# Altium schematic sheet Top.SchDoc
size A4; SheetNumber: 1; SheetTotal: 1
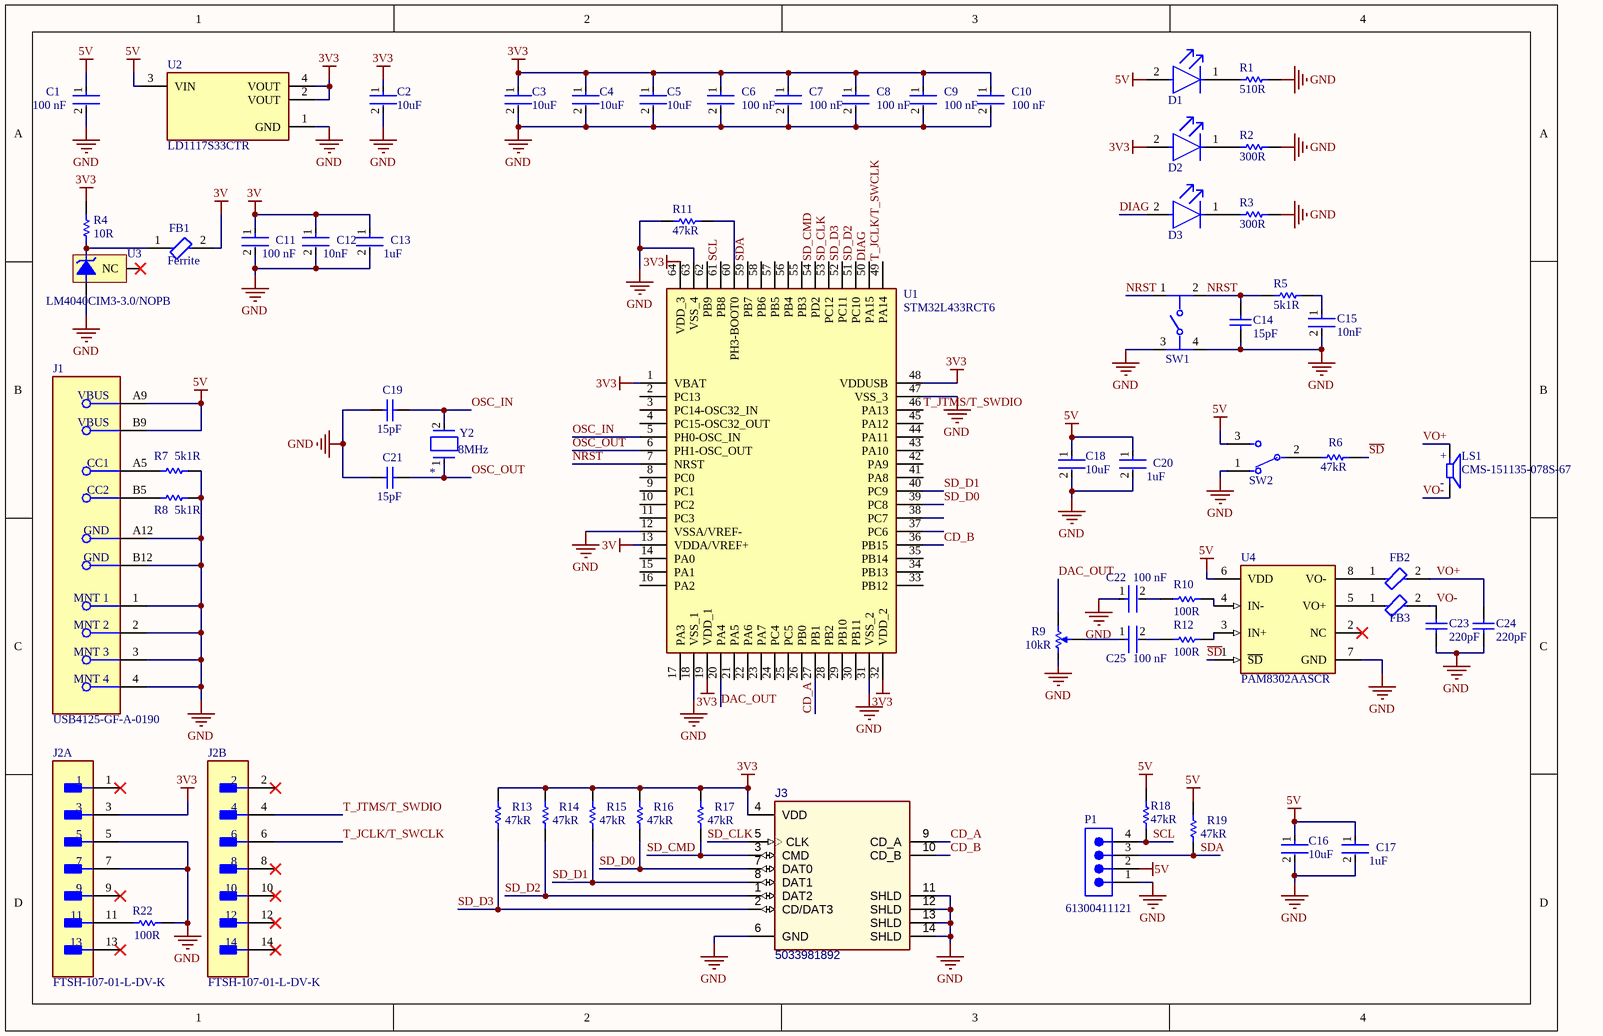
[diagram p0: Top.SchDoc]

## Parts
C1  value 100 nF  [FP-CC0805-0_85-MFG]  (hidden comment: CC0805KRX7R7BB104)
C2  value 10uF  [FP-C0805C-DG-MFG]  (hidden comment: C0805C106K8PACTU)
C3  value 10uF  [FP-C0805C-DG-MFG]  (hidden comment: C0805C106K8PACTU)
C4  value 10uF  [FP-C0805C-DG-MFG]  (hidden comment: C0805C106K8PACTU)
C5  value 10uF  [FP-C0805C-DG-MFG]  (hidden comment: C0805C106K8PACTU)
C6  value 100 nF  [FP-CC0805-0_85-MFG]  (hidden comment: CC0805KRX7R7BB104)
C7  value 100 nF  [FP-CC0805-0_85-MFG]  (hidden comment: CC0805KRX7R7BB104)
C8  value 100 nF  [FP-CC0805-0_85-MFG]  (hidden comment: CC0805KRX7R7BB104)
C9  value 100 nF  [FP-CC0805-0_85-MFG]  (hidden comment: CC0805KRX7R7BB104)
C10  Capacitance: 100 nF  [FP-CC0805-0_85-MFG]  (hidden comment: CC0805KRX7R7BB104)
C11  Capacitance: 10nF  [FP-C0805C-DN-MFG]  (hidden comment: C0805C103K2RACTU)
C12  value 100 nF  [FP-CC0805-0_85-MFG]  (hidden comment: CC0805KRX7R7BB104)
C13  Capacitance: 1uF  [FP-C2012-125-0_2-IPC_A]  (hidden comment: C2012X5R1E105K125AA)
C14  value 15pF  [CAPC1508X91X25LL25T13]  (hidden comment: 06032U150GAT2A)
C15  Capacitance: 10nF  [FP-C0805C-DN-MFG]  (hidden comment: C0805C103K2RACTU)
C16  value 10uF  [FP-C0805C-DG-MFG]  (hidden comment: C0805C106K8PACTU)
C17  Capacitance: 1uF  [FP-C2012-125-0_2-IPC_A]  (hidden comment: C2012X5R1E105K125AA)
C18  value 10uF  [FP-C0805C-DG-MFG]  (hidden comment: C0805C106K8PACTU)
C19  value 15pF  [CAPC1508X91X25LL25T13]  (hidden comment: 06032U150GAT2A)
C20  Capacitance: 1uF  [FP-C2012-125-0_2-IPC_A]  (hidden comment: C2012X5R1E105K125AA)
C21  value 15pF  [CAPC1508X91X25LL25T13]  (hidden comment: 06032U150GAT2A)
C22  value 100 nF  [FP-CC0805-0_85-MFG]  (hidden comment: CC0805KRX7R7BB104)
C23  value 220pF  [CAPC2013X88X50ML20T25]  (hidden comment: C0805C221K5RACTU)
C24  value 220pF  [CAPC2013X88X50ML20T25]  (hidden comment: C0805C221K5RACTU)
C25  value 100 nF  [FP-CC0805-0_85-MFG]  (hidden comment: CC0805KRX7R7BB104)
D1  SML-LXT0805IW-TR  [FP-SML-LXT0805IW-TR-MFG]  (value not drawn)
D2  SML-LXT0805IW-TR  [FP-SML-LXT0805IW-TR-MFG]  (value not drawn)
D3  SML-LXT0805IW-TR  [FP-SML-LXT0805IW-TR-MFG]  (value not drawn)
FB1  Core Material: Ferrite  [FP-BLM21-0_2-t0_85-e0_5-MFG]  (hidden comment: BLM21AG151SN1D)
FB2  MMZ1608B121CTAH0  [FP-MMZ1608-0_6-MFG]  (value not drawn)
FB3  MMZ1608B121CTAH0  [FP-MMZ1608-0_6-MFG]  (value not drawn)
J1  USB4125-GF-A-0190  [FP-USB4125-GF-A-0190-MFG]
J2  FTSH-107-01-L-DV-K  [FP-FTSH-107-01-L-DV-K-MFG]  (parts A,B of 2)
J3  5033981892  [MOLX-5033981892_V]
LS1  CMS-151135-078S-67  [SPKR_CMS-151135-078S-67]
P1  61300411121  [61300411121]
R1  value 510R  [RESC2013X60X35LL10T20]  (hidden comment: RC0805JR-07510RL)
R2  value 300R  [RESC2013X60X35LL10T20]  (hidden comment: RC0805JR-07300RL)
R3  value 300R  [RESC2013X60X35LL10T20]  (hidden comment: RC0805JR-07300RL)
R4  Resistance: 10R  [RESC2013X60X35ML10T20]  (hidden comment: RC0805FR-0710RL)
R5  value 5k1R  [RESC2013X60X35ML10T20]  (hidden comment: RC0805JR-075K1L)
R6  value 47kR  [RESC2013X60X35NL10T20]  (hidden comment: RC0805JR-1347KL)
R7  value 5k1R  [RESC2013X60X35ML10T20]  (hidden comment: RC0805JR-075K1L)
R8  value 5k1R  [RESC2013X60X35ML10T20]  (hidden comment: RC0805JR-075K1L)
R9  Resistance: 10kR  [BOUR-TC33X-2_V]  (hidden comment: TC33X-2-103E)
R10  Resistance: 100R  [RESC2013X60X35ML10T20]  (hidden comment: RC0805FR-07100RL)
R11  value 47kR  [RESC2013X60X35NL10T20]  (hidden comment: RC0805JR-1347KL)
R12  Resistance: 100R  [RESC2013X60X35ML10T20]  (hidden comment: RC0805FR-07100RL)
R13  value 47kR  [RESC2013X60X35NL10T20]  (hidden comment: RC0805JR-1347KL)
R14  value 47kR  [RESC2013X60X35NL10T20]  (hidden comment: RC0805JR-1347KL)
R15  value 47kR  [RESC2013X60X35NL10T20]  (hidden comment: RC0805JR-1347KL)
R16  value 47kR  [RESC2013X60X35NL10T20]  (hidden comment: RC0805JR-1347KL)
R17  value 47kR  [RESC2013X60X35NL10T20]  (hidden comment: RC0805JR-1347KL)
R18  value 47kR  [RESC2013X60X35NL10T20]  (hidden comment: RC0805JR-1347KL)
R19  value 47kR  [RESC2013X60X35NL10T20]  (hidden comment: RC0805JR-1347KL)
R22  Resistance: 100R  [RESC2013X60X35ML10T20]  (hidden comment: RC0805FR-07100RL)
SW1  PTS645SM43SMTR92LFS  [FP-PTS645SM43SMTR92LFS-MFG]  (value not drawn)
SW2  JS102011JCQN  [FP-JS102011JCQN-MFG]  (value not drawn)
U1  STM32L433RCT6  [QFP50P1200X1200X160-64N]
U2  LD1117S33CTR  [FP-SOT-223-0046067_14-MFG]
U3  LM4040CIM3-3.0/NOPB  [MF03A_N]
U4  PAM8302AASCR  [FP-MSOP-8-MFG]
Y2  Frequency: 8MHz  [FP-ABM3-MFG]  (hidden comment: ABM3-8.000MHZ-B4Y-T)

## Nets
3V: C11.1 C12.1 C13.1 FB1.2 U1.13(VDDA/VREF+)
3V3: C2.1 C3.1 C4.1 C5.1 C6.1 C7.1 C8.1 C9.1 C10.1 D2.2(A) J2.3 J3.4(VDD) R4.2 R13.1 R14.1 R15.1 R16.1 R17.1 U1.1(VBAT) U1.19(VDD_1) U1.32(VDD_2) U1.48(VDDUSB) U1.64(VDD_3) U2.2(VOUT) U2.4(VOUT)
5V: C1.1 C16.1 C17.1 C18.1 C20.1 D1.2(A) J1.A9(VBUS) J1.B9(VBUS) P1.2 R18.2 R19.1 SW2.3 U2.3(VIN) U4.6(VDD)
GND: C1.2 C2.2 C3.2 C4.2 C5.2 C6.2 C7.2 C8.2 C9.2 C10.2 C11.2 C12.2 C13.2 C14.1 C15.2 C16.2 C17.2 C18.2 C19.1 C20.2 C21.1 C22.1 C23.1 C24.1 J1.1(MNT_1) J1.2(MNT_2) J1.3(MNT_3) J1.4(MNT_4) J1.A12(GND) J1.B12(GND) J2.5 J2.7 J3.6(GND) J3.11(SHLD) J3.12(SHLD) J3.13(SHLD) J3.14(SHLD) P1.1 R1.1 R2.1 R3.1 R7.1 R8.1 R9.1 R11.1 R22.2 SW1.3 SW1.4 SW2.1 U1.12(VSSA/VREF-) U1.18(VSS_1) U1.31(VSS_2) U1.47(VSS_3) U1.63(VSS_4) U2.1(GND) U3.2(-V) U4.7(GND)
~{SD}: R6.1 U4.1(~{SD})
CD_A: J3.9(CD_A) U1.27(PB1)
CD_B: J3.10(CD_B) U1.36(PB15)
DAC_OUT: R9.3 U1.20(PA4)
DIAG: D3.2(A) U1.50(PA15)
NRST: C14.2 R5.2 SW1.1 SW1.2 U1.7(NRST)
OSC_IN: C19.2 U1.5(PH0-OSC_IN) Y2.2
OSC_OUT: C21.2 U1.6(PH1-OSC_OUT) Y2.1
SCL: P1.4 R18.1 U1.61(PB8)
SD_CLK: J3.5(CLK) U1.53(PC12)
SD_CMD: J3.3(CMD) R17.2 U1.54(PD2)
SD_D0: J3.7(DAT0) R16.2 U1.39(PC8)
SD_D1: J3.8(DAT1) R15.2 U1.40(PC9)
SD_D2: J3.1(DAT2) R14.2 U1.51(PC10)
SD_D3: J3.2(CD/DAT3) R13.2 U1.52(PC11)
SDA: P1.3 R19.2 U1.59(PB7)
T_JCLK/T_SWCLK: J2.6 U1.49(PA14)
T_JTMS/T_SWDIO: J2.4 U1.46(PA13)
VO+: C24.2 FB2.2 LS1.P
VO-: C23.2 FB3.2 LS1.M
NetC15_1: C15.1 R5.1
NetC22_2: C22.2 R10.1
NetC25_1: C25.1 R9.2
NetC25_2: C25.2 R12.1
NetD1_1: D1.1(C) R1.2
NetD2_1: D2.1(C) R2.2
NetD3_1: D3.1(C) R3.2
NetFB1_1: FB1.1 R4.1 U3.1(+V)
NetFB2_1: FB2.1 U4.8(VO-)
NetFB3_1: FB3.1 U4.5(VO+)
NetJ1_A5: J1.A5(CC1) R7.2
NetJ1_B5: J1.B5(CC2) R8.2
NetJ2_11: J2.11 R22.1
NetR6_2: R6.2 SW2.2
NetR10_2: R10.2 U4.4(IN-)
NetR11_2: R11.2 U1.60(PH3-BOOT0)
NetR12_2: R12.2 U4.3(IN+)

Not connected (* = marked no-connect by the designer): J2 1* 2* 8* 9* 10* 12* 13* 14*; U1 2(PC13) 3(PC14-OSC32_IN) 4(PC15-OSC32_OUT) 8(PC0) 9(PC1) 10(PC2) 11(PC3) 14(PA0) 15(PA1) 16(PA2) 17(PA3) 21(PA5) 22(PA6) 23(PA7) 24(PC4) 25(PC5) 26(PB0) 28(PB2) 29(PB10) 30(PB11) 33(PB12) 34(PB13) 35(PB14) 37(PC6) 38(PC7) 41(PA8) 42(PA9) 43(PA10) 44(PA11) 45(PA12) 55(PB3) 56(PB4) 57(PB5) 58(PB6) 62(PB9); U3 3(NC)*; U4 2(NC)*

## Notes on the sheet
- (in symbol CMP-006-000000-5) +; -

## Library data of the parts
C1 C6-C10 C12 C22 C25 = CMP-1036-04402-6: CAP CER 0.1UF 16V X7R 0805; Manufacturer: Yageo; Material: Ceramic; Tolerance: 0.1; Manufacturer Part Number: CC0805KRX7R7BB104; Temperature: -30°C to +85°C; Lead Free: Yes; Footprint Url: http://www.yageo.com/exep/pages/download/literatures/UPY-C_GEN_24.pdf; Voltage Rating: 16 V; Package: CC0805-0.85; RoHS: TRUE; Digikey Description: CAP CER 0.1UF 16V X7R 0805; Category: Cap; Octopart: https://octopart.com/cc0805krx7r7bb104-yageo-39467769; Device Class L3: Ceramic Capacitors; ComponentLink2URL: http://www.yageo.com/documents/recent/UPY-GPHC_Y5V_6.3V-to-50V_8.pdf; Temperature Range Low: -30°C; Mouser Description: Multilayer Ceramic Capacitors MLCC - SMD/SMT 100nF 16V X7R 10%; Automotive: No; Device Class L2: Capacitors; Height: 0.95mm; ComponentLink2Description: Datasheet; Temperature Characteristic: X7R; Ipc Land Pattern Name: CAPC200125X85; Device Class L1: Passive Components; Temperature Range High: +85°C
  C1 C6-C9 C12 C22 C25: Capacitance: 100 nF
C2-C5 C16 C18 = CMP-2007-03243-2: CAP CER 10UF 10V X5R 0805; Manufacturer: Kemet; 3DS Part Number: 220-00001; Tolerance: 10%; Temperature Coefficient: 15%; Material: Ceramic; Device Class L2: Capacitors; Device Class L1: Passive Components; ComponentLink2URL: https://content.kemet.com/datasheets/KEM_C1006_X5R_SMD.pdf; Height: 1.4mm; Lead Free: Yes; Manufacturer Part Number: C0805C106K8PACTU; Digikey Description: CAP CER 10UF 10V X5R 0805; Octopart: https://octopart.com/c0805c106k8pactu-kemet-98697; Capacitance: 10uF; Temperature Range Low: -55°C; Temperature: -55°C to +85°C; Automotive: No; Mouser Description: CAP CER 10UF 10V X5R 0805; Ipc Land Pattern Name: CAPC200125X125; Temperature Range High: +85°C; Voltage: 10V; RoHS: TRUE; Device Class L3: Ceramic Capacitors; ComponentLink2Description: Datasheet; Voltage Rating: 10V; Package: C0805C-DG; Temperature Characteristic: X5R; Category: Cap
C11 C15 = CMP-2007-00259-2: CAP CER 10000PF 200V X7R 0805; Manufacturer: KEMET; Material: Ceramic; Temperature Coefficient: 30ppm/°C; Tolerance: 0.1; Value: 10,000 pF; Device Class L2: Capacitors; Voltage Rating: 200 V; Temperature Range High: +125°C; ComponentLink2Description: Datasheet; Height: 0.88mm; Octopart: https://octopart.com/c0805c103k2ractu-kemet-9138347; ComponentLink2URL: https://content.kemet.com/datasheets/KEM_C1003_C0G_SMD.pdf; Category: Cap; Temperature: -55°C to +125°C; Temperature Range Low: -55°C; Digikey Description: CAP CER 10000PF 200V X7R 0805; Manufacturer Part Number: C0805C103K2RACTU; Temperature Characteristic: X7R; Automotive: No; Device Class L3: Ceramic Capacitors; Mouser Description: KEMET - C0805C103K2RACTU - CAP, MLCC, X7R, 10NF, 200V, 0805; RoHS: TRUE; Device Class L1: Passive Components; Lead Free: Yes; Package: C0805C-DN; Ipc Land Pattern Name: CAPC200125X78
C13 C17 C20 = CMP-08246-005389-1: Multilayer Ceramic Capacitors 1μF ±10% 25V X5R SMD 0805; Min Operating Temperature: -55°C; Construction: Flat; Package Quantity: 2000; Height: 1.25mm; Resistor Type: Ceramic; Case/Package: 0805; Depth: 1.25mm; Case Code (Metric): 2012; Weight: 0.000194oz; REACH SVHC: No SVHC; Dielectric: X5R; Max Operating Temperature: 85°C; Number of Pins: 2; Thickness: 0.057inch; RoHS Compliant: Yes; Radiation Hardening: No; Lead Free: Lead Free; Case Code (Imperial): 0805; Length: 2mm; Voltage Rating: 25V; Mount: Surface Mount; Voltage Rating (DC): 25V; Packaging: Tape and Reel; Dielectric Material: Ceramic; Termination: SMD/SMT; Voltage: 25V; Tolerance: 10%; Series: C; Width: 0.049inch
C14 C19 C21 = CMP-2006-04659-1: Manufacturer: AVX Interconnect / Elco; Part Number: 06032U150GAT2A
C23 C24 = CMP-2007-00321-1: Manufacturer: Kemet; Part Number: C0805C221K5RACTU
D1-D3 = CMP-1724-00002-2: LED RED DIFFUSED SMD; Lens Style: Rectangular; Luminous Intensity: 11mcd; Approvals: UL; Test Current: 20mA; Forward Voltage: 2V; Number of LEDs: 1; Wavelength: 635nm; Lens Color: White; Viewing Angle: 140°; Min Operating Temperature: -25°C; Case Code (Metric): 2012; Mount: Surface Mount; Case Code (Imperial): 0805; Height: 0.8mm; Lead Free: Lead Free; Color: Red; Package Quantity: 1; Illumination Color: Red; Lens Transparency: Diffused; Forward Current: 20mA; Packaging: Tape and Reel; Length: 2mm; Case/Package: 0805; REACH SVHC: No SVHC; Width: 1.25mm; Number of Pins: 2; Max Operating Temperature: 80°C; Dominant Wavelength: 635nm
FB1 = CMP-0686-00717-3: Chip Ferrite Bead, 0805, 150Ω @ 100MHz, 0.09Ω, 25%, 1A; Number of Circuits: 1; Max Current Rating: 800mA; DC Resistance (DCR): 100mR; Shielding: Unshielded; DC Current: 200mA; Impedance: 150R; Contact Plating: Tin; Weight: 0.000194oz; Series: EMIFIL®, BLM21A; Test Frequency: 100MHz; Case Code (Metric): 2012; Package Quantity: 4000; Lead Free: Lead Free; Max Operating Temperature: 125°C; Case Code (Imperial): 0805; Material: Ferrite; Min Operating Temperature: -55°C; Tolerance: 25%; Length: 2mm; DC Resistance-Max: 100mR; Width: 1.25mm; RoHS Compliant: Yes; Packaging: Tape and Reel; REACH SVHC: No SVHC; Depth: 1.45mm; Number of Pins: 2; Radiation Hardening: No; Current Rating: 800mA; Height: 0.85mm; Termination: SMD/SMT; Number of Lines: 1; Max DC Current: 200mA; Case/Package: 0805
FB2 FB3 = CMP-08257-000037-1: FERRITE BEAD 120 OHM 0603 1LN; Tolerance: 25%; DC Resistance (DCR): 150mR; Max DC Current: 600mA; Impedance: 120R; Package Quantity: 4000; Case Code (Imperial): 0603; Width: 0.031inch; REACH SVHC: No SVHC; Depth: 0.8mm; Core Material: Ferrite; Packaging: Cut Tape; Case/Package: 0603; Length: 0.063inch; RoHS Compliant: Yes; Case Code (Metric): 1608; Height: 0.03inch; Mount: Surface Mount; Current Rating: 600mA
J1 = CMP-245163-000004-1: CONN RCPT TYPE C 6P SMD RA
J2 = CMP-02766-001412-1: CONN HEADER SMD 14POS 1.27MM; Number of Contacts: 14; Gender: Male; Termination: Solder; Lead Free: Lead Free; Depth: 5.84mm; Min Operating Temperature: -55°C; Length: 8.89mm; RoHS Compliant: Yes; Housing Material: Polymer; Housing Color: Black; Max Operating Temperature: 125°C; Number of Rows: 2; Pitch: 1.27mm; Radiation Hardening: No; Orientation: Straight; Packaging: Rail/Tube; Contact Material: Bronze; Contact Plating: Gold
J3 = CMP-002-00049-4: Micro SD Card Connector, Pitch 1.1 mm, 8 Position, Height 1.4 mm, -25 to 85 degC, RoHS, Tape and Reel; Pins: 14
LS1 = CMP-006-000000-5: 15 x 11 mm, Rectangular Frame, 0.7 W, 8 Ohm, Neodymium Magnet, Mylar Cone, Spring Contacts; MF: {'manufacturer': u'CUI'}; Design Item ID: CMS-151135-078S-67; Component Type: Standard; MP: CMS-151135-078S-67; Pin Count: 2; Value: *; Source: CMS-151135-078S-67.SchLib; Price: None; Package: None; Availability: Unavailable
P1 = CMP-1502-01064-2: NexarPartId: 32855522; Pitch: 2.54mm; Number of Contacts: 4; Contact Resistance: 20mΩ; Gender: Male; Current Rating: 3A; Connector Type: Male Pin; Voltage Rating: 250V; Lead Free: Lead Free; Contact Plating: Gold; Max Operating Temperature: 105°C; Packaging: Bulk; Height: 8.89mm; Orientation: Vertical; Contact Mating Length: 5.9944mm; Contact Material: Copper; Lead Pitch: 2.54mm; Min Operating Temperature: -40°C; Termination: Solder; Color: Black; Number of Rows: 1; REACH SVHC: Unknown; RoHS: Compliant; Mount: Through Hole; Number of Positions: 4; Number of Pins: 4; Operating Supply Voltage: 250V
R1 = CMP-1013-00067-2: Manufacturer: Yageo; Part Number: RC0805JR-07510RL
R2 R3 = CMP-2001-01368-1: Manufacturer: Yageo; Part Number: RC0805JR-07300RL
R4 = CMP-2100-03670-1: Chip Resistor, 10 Ohm, +/- 1%, 0.125 W, -55 to 155 degC, 0805 (2012 Metric), RoHS, Tape and Reel; Manufacturer: Yageo; Power Rating: 125mW; Voltage Rating: 150V; Temperature Coefficient: 200ppm/degreesC; Number of Pins: 2; REACH SVHC: NoSVHC; Datasheet Version: Rev. 5, 10/2016; Max Operating Temperature: 155degC; Manufacturer URL: http://www.yageo.com/; Case Code (Imperial): 0805; Package Description: 2-Pin Surface Mounted Device, Body 2 x 1.25 mm; Case Code (Metric): 2012; Length: 2mm; RoHSCompliant: true; Max Power Dissipation: 125mW; Depth: 1.25mm; Packaging: TapeandReel; Height: 0.5mm; Package Reference: 0805; Package Quantity: 1; Tolerance: 1%; Termination: SMD/SMT; Min Operating Temperature: -55degC; Lead Free: LeadFree; Width: 1.25mm; Voltage Rating (DC): 150V; Datasheet URL: http://www.yageo.com/NewPortal/yageodocoutput?fileName=/pdf/R-Chip/PYu-RC_Group_51_RoHS_L_5.pdf; Composition: ThickFilm; Number of Terminations: 2; Case/Package: 0805
R5 R7 R8 = CMP-2001-01390-1: Manufacturer: Yageo; Part Number: RC0805JR-075K1L
R6 R11 R13-R19 = CMP-2001-01422-1: Manufacturer: Yageo; Part Number: RC0805JR-1347KL
R9 = CMP-2100-03695-1: Trimming Potentiometer, 10000 Ohm, -40 to 100 degC, 3-Pin SMD, RoHS, Tape and Reel; Manufacturer: Bourns; Tolerance: 25%; Max Power Dissipation: 100mW; Number of Turns: 1; Temperature Coefficient: 250ppm/degreesC; Voltage Rating (DC): 50V; Datasheet URL: http://www.bourns.com/docs/Product-Datasheets/TC33.pdf; Composition: Potentiometer; Package Description: 3-Pin Surface Mount Device, Body 3.8 x 3.6 mm; Weight: 29.4mg; Power Rating: 100mW; Termination: FootPrint; Manufacturer URL: http://www.bourns.com/; Width: 0.118inch; Height: 0.047inch; Military Standard: Not; Radiation Hardening: No; Colour: Silver; Case/Package: SMD/SMT; Depth: 3.8mm; Min Operating Temperature: -40degC; Lead Free: LeadFree; Datasheet Version: 42583.0; REACH SVHC: NoSVHC; Length: 3mm; RoHSCompliant: true; Contact Plating: Silver; Taper: Linear; Packaging: TapeandReel; Mount: SurfaceMount; Max Operating Temperature: 100degC; Package Reference: TC33X-2; Package Quantity: 2500
R10 R12 R22 = CMP-2100-03669-1: Chip Resistor, 100 Ohm, +/-1%, 0.125 W, -55 to 155 degC, 0805 (2012 Metric), RoHS, Tape and Reel; Manufacturer: Yageo; Power Rating: 125mW; Voltage Rating: 150V; Tolerance: 1%; Temperature Coefficient: 100ppm/degreesC; Length: 2mm; Package Description: 2-Pin Surface Mounted Device, Body 2 x 1.25 mm; Case Code (Imperial): 0805; Number of Pins: 2; Termination: SMD/SMT; Lead Pitch: 0.4mm; Package Quantity: 1; Height: 0.024inch; Case Code (Metric): 2012; Number of Terminations: 2; Datasheet Version: Rev. 5, 10/2016; Lead Free: LeadFree; Package Reference: 0805; Composition: ThickFilm; REACH SVHC: Unknown; Voltage Rating (DC): 150V; Min Operating Temperature: -55degC; Packaging: TapeandReel; Military Standard: Not; Case/Package: 0805; Datasheet URL: http://www.yageo.com/NewPortal/yageodocoutput?fileName=/pdf/R-Chip/PYu-RC_Group_51_RoHS_L_5.pdf; Max Operating Temperature: 155degC; Manufacturer URL: http://www.yageo.com/; Max Power Dissipation: 125mW; Width: 0.049inch; Depth: 1.25mm; RoHSCompliant: true
SW1 = CMP-2000-05160-2: SWITCH TACTILE SPST-NO 0.05A 12V; Contact Resistance: 100mR; Throw Configuration: SPST; Illumination Type: Non-Illuminated; Mechanical Life: 100000Cycles; Current Rating: 50mA; Switch Function: Off-Mom; Actuator Length: 0.85mm; Actuator Material: Nylon; Actuator Type: Standard; Operating Force: 160gf; Min Operating Temperature: -20°C; REACH SVHC: No SVHC; Termination: Gull Wing; Case/Package: SMD/SMT; Packaging: Tape and Reel; Mount: Surface Mount; Voltage Rating (DC): 12V; Orientation: Straight; Lead Free: Lead Free; Contact Material: Silver; Color: Black; Max Current Rating: 50mA; Contact Plating: Silver; Depth: 9mm; Package Quantity: 1; Max Voltage Rating (DC): 12V; Length: 6mm; Max Operating Temperature: 60°C
SW2 = CMP-10038-000010-1: SWITCH SLIDE SPDT 300MA 6V; Electrical Life: 5000Cycles; Switch Function: On-On; Actuator Material: Nylon; Actuator Length: 2mm; Actuator Type: Standard; Current Rating: 300mA; Voltage Rating (DC): 6V; Min Operating Temperature: -40°C; Throw Configuration: SPDT; Mount: Surface Mount; Switch Travel: 2mm; Max Operating Temperature: 85°C; Packaging: Cut Tape; Contact Plating: Silver; Contact Material: Copper Alloy
U1 = CMP-004-000000-2: STMICROELECTRONICS - STM32L433RCT6 - MCU, ARM CORTEX-M4, 80MHZ, LQFP-64; Geometry.Height: 1.6mm; Source: STM32L433RCT6.SchLib; Mouser Price/Stock: https://www.mouser.co.uk/ProductDetail/STMicroelectronics/STM32L433RCT6?qs=dTJS0cRn7ogcky%2FxWSmKQA%3D%3D; Arrow Part Number: STM32L433RCT6; Manufacturer_Name: STMicroelectronics; Mouser Part Number: 511-STM32L433RCT6; Design Item ID: STM32L433RCT6; Manufacturer_Part_Number: STM32L433RCT6; Datasheet Link: https://www.st.com/resource/en/datasheet/stm32l433rc.pdf; Arrow Price/Stock: https://www.arrow.com/en/products/stm32l433rct6/stmicroelectronics?region=nac
U2 = CMP-0244-00307-2: IC REG LINEAR 3.3V 800MA SOT223; Input Bias Current: 5mA; Output Voltage Accuracy: 1%; Dropout Voltage: 1.1V; Power Dissipation: 12W; Polarity: Positive; Min Input Voltage: 5.3V; Quiescent Current: 10mA; Max Output Current: 1.3A; Output Current: 950mA; Number of Regulators: 1; Max Supply Voltage: 15V; Output Type: Fixed; Output Voltage: 3.3V; Number of Terminals: 4; Min Supply Voltage: 3.3V; Termination: SMD/SMT; Mount: Surface Mount; Max Power Dissipation: 12W; Case/Package: SOT-223; Lead Free: Lead Free; Height: 1.8mm; REACH SVHC: No SVHC; Radiation Hardening: No; Width: 3.5mm; Length: 6.5mm; Packaging: Tape and Reel; Max Input Voltage: 15V; Accuracy: 1%; Weight: 0.01lb; Contact Plating: Tin; Max Operating Temperature: 125°C; Number of Pins: 4; Max Output Voltage: 3.3V; Min Operating Temperature: -40°C; Nominal Output Voltage: 3.3V; Package Quantity: 1; Min Output Voltage: 3.3V; Number of Outputs: 1
U3 = CMP-0074-00579-2: Precision Micropower Shunt Voltage Reference, 3-pin SOT-23, Pb-Free; Manufacturer: National Semiconductor; PackageTopMarking: RKC*XTT; CompType: Voltage Reference IC; PowerWise: N; PackageReference: MF03A; PinCount: 3; ComponentLink1Description: LM4040 Datasheet; DatasheetVersion: Apr-2005; ComponentLink3URL: http://www.national.com/packaging/folders/mf03a.html; ComponentLink2URL: http://www.national.com/pf/LM/LM4040.html; ComponentLink1URL: http://www.national.com/ds/LM/LM4040.pdf; PackageVersion: revB, Mar-2003; RoHS: Y; RevisionNote: Component URLs added; ComponentLink2Description: LM4040 Web Page; ComponentLink3Description: MF03A Package Page; PackageDescription: Molded SOT-23, .115 x .051 x .037in Body, 3 Lead, .075 in Pitch
U4 = CMP-12733-000002-1: IC AMP CLASS D MONO 2.5W 8MSOP; Manufacturer: Diodes Inc.; Nominal Supply Current: 4mA; Number Of Channels: 1; Max Junction Temp: +125°C; Min Supply Voltage: 2V; Power At Speaker R: 2.5W @ 4Ω; Max Supply Voltage: 5.5V; Voltage Gain: 24dB; Standoff Height: 0.05mm; Manufacturer Part Number: PAM8302AASCR; ComponentLink2URL: https://www.diodes.com/assets/Datasheets/PAM8302A.pdf; Mouser Description: Audio Amplifiers 2.5W MONO FILTERLESS CLASS-D AUDIO AMP; ComponentLink2Description: Datasheet; Temperature: -40°C to +85°C; Automotive: No; Footprint Url: https://www.diodes.com/assets/Package-Files/MSOP-8.pdf; Device Class L1: Integrated Circuits (ICs); Temperature Range Low: -40°C; Temperature Range High: +85°C; Lead Free: Yes; Package: MSOP-8; Height: 1.1mm; Category: IC; Ipc Land Pattern Name: SOP65P490X110-8; Octopart: https://octopart.com/pam8302aascr-diodes+inc.-29030473; RoHS: TRUE; Device Class L3: Amplifiers - Audio; Device Class L2: Linear ICs; Digikey Description: IC AMP CLASS D MONO 2.5W 8MSOP
Y2 = CMP-27762-013675-1: Crystal 8MHz ±30ppm 18pF SMD-2 5mm x 3.2mm; ESR (Equivalent Series Resistance): 140R; Max Operating Temperature: 70°C; Frequency Stability: 30ppm; RoHS Compliant: Yes; Width: 0.126inch; Min Operating Temperature: -20°C; Frequency Tolerance: 30ppm; Packaging: Tape and Reel; Height: 0.051inch; Mount: Surface Mount; Load Capacitance: 18pF; Length: 0.197inch; Case/Package: SMD/SMT; Parameter 1: *